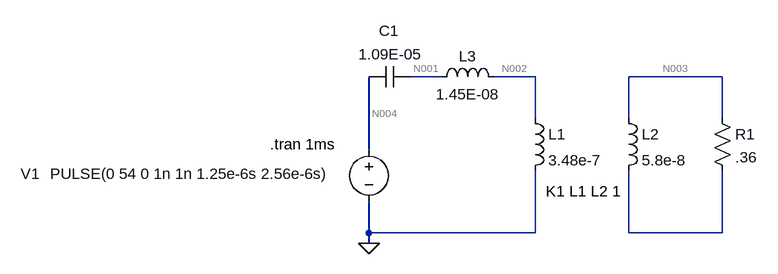
[diagram p0: schematic Resonant Simulation.asc]
Resonant Simulation.asc, the LTspice schematic file:
Version 4.1
SHEET 1 880 680
WIRE 224 -192 176 -192
WIRE 368 -192 304 -192
WIRE 656 -192 512 -192
WIRE 368 -128 368 -192
WIRE 512 -128 512 -192
WIRE 656 -128 656 -192
WIRE 112 -80 112 -192
WIRE 112 48 112 0
WIRE 368 48 368 -48
WIRE 368 48 112 48
WIRE 512 48 512 -48
WIRE 656 48 656 -48
WIRE 656 48 512 48
WIRE 112 64 112 48
FLAG 112 64 0
SYMBOL voltage 112 -96 R0
WINDOW 0 -536 53 Left 2
WINDOW 3 -491 53 Left 2
WINDOW 123 0 0 Left 0
WINDOW 39 0 0 Left 0
SYMATTR InstName V1
SYMATTR Value PULSE(0 54 0 1n 1n 1.25e-6s 2.56e-6s)
SYMBOL cap 176 -208 R90
WINDOW 0 -39 33 VBottom 2
WINDOW 3 -34 31 VTop 2
SYMATTR InstName C1
SYMATTR Value 1.09E-05
SYMBOL ind 352 -144 R0
SYMATTR InstName L1
SYMATTR Value 3.48e-7
SYMATTR Type ind
SYMBOL ind 496 -144 R0
SYMATTR InstName L2
SYMATTR Value 5.8e-8
SYMATTR Type ind
SYMBOL res 640 -144 R0
SYMATTR InstName R1
SYMATTR Value .36
SYMBOL ind 208 -176 R270
WINDOW 0 32 56 VTop 2
WINDOW 3 5 56 VBottom 2
SYMATTR InstName L3
SYMATTR Value 1.45E-08
TEXT -40 -88 Left 2 !.tran 1ms
TEXT 384 -16 Left 2 !K1 L1 L2 1

The netlist it stands for:
* Resonant Simulation.asc
V1 N004 0 PULSE(0 54 0 1n 1n 1.25e-6s 2.56e-6s)
C1 N001 N004 1.09E-05
L1 N002 0 3.48e-7
L2 N003 N005 5.8e-8
R1 N003 N005 .36
L3 N001 N002 1.45E-08
.tran 1ms
K1 L1 L2 1
.backanno
.end

* Results of the author's LTspice run, read from the files saved beside the schematic
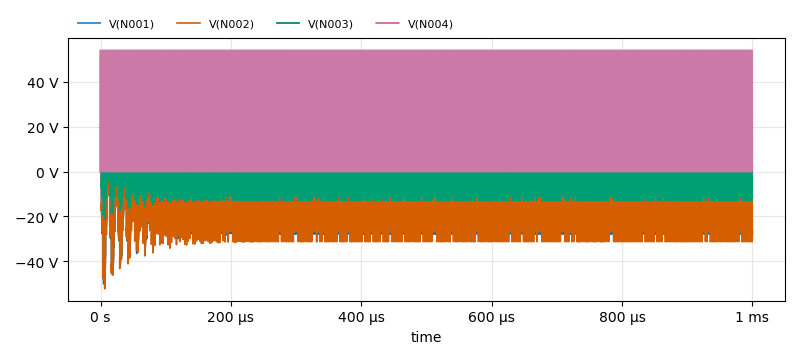
[diagram p1: Transient Analysis of Resonant Simulation.asc, plotted from the saved traces]
* Transient Analysis, 1 run:
*   V(N001): min -50.08 V, max 54 V, average 8.464 mV, rms 28.07 V, last -27.84 V
*   V(N002): min -52.23 V, max 51.72 V, average 8.001 mV, rms 26.95 V, last -26.73 V
*   V(N003): min -21.31 V, max 21.12 V, average 3.779 mV, rms 11 V, last -10.95 V
*   V(N004): min 0 V, max 54 V, average 26.41 V, rms 37.77 V, last 0 V